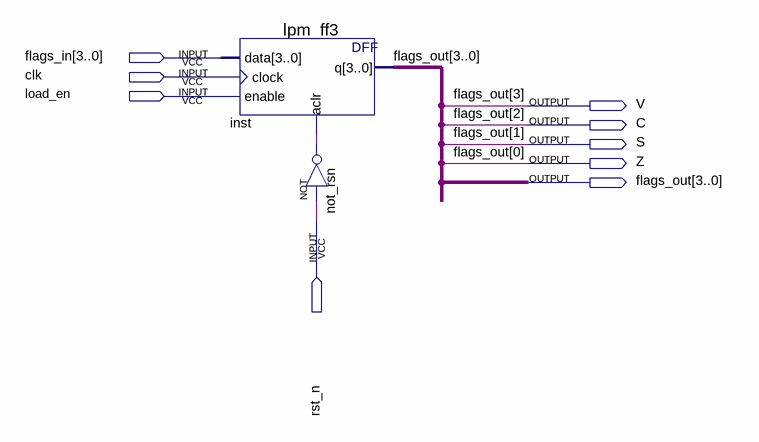
[diagram p0: schematic sheet]
// Quartus schematic fr_unit.bdf as structural Verilog: 2 symbols, 9 pins
module fr_unit (
  input  [3:0] flags_in,
  input  clk,
  input  load_en,
  input  rst_n,
  output V,
  output C,
  output S,
  output Z,
  output [3:0] flags_out
);

  wire not_rsn_out;

  lpm_ff3 inst (
    .data(flags_in), .clock(clk), .enable(load_en), .aclr(not_rsn_out), .q({flags_out[3], C, flags_out[1:0]}));
  not not_rsn (not_rsn_out, rst_n);

  assign flags_out[2] = C;
  assign S = flags_out[1];
  assign V = flags_out[3];
  assign Z = flags_out[0];
endmodule
